# EasyEDA schematic SCH_EDR Project_2023-04-14.json
TITLE: Soil moisture meter; REV: 1.0; Date: 2023-04-14; Sheet: 1/1; Drawn By: charith_dombawala; Company: University Of Moratuwa
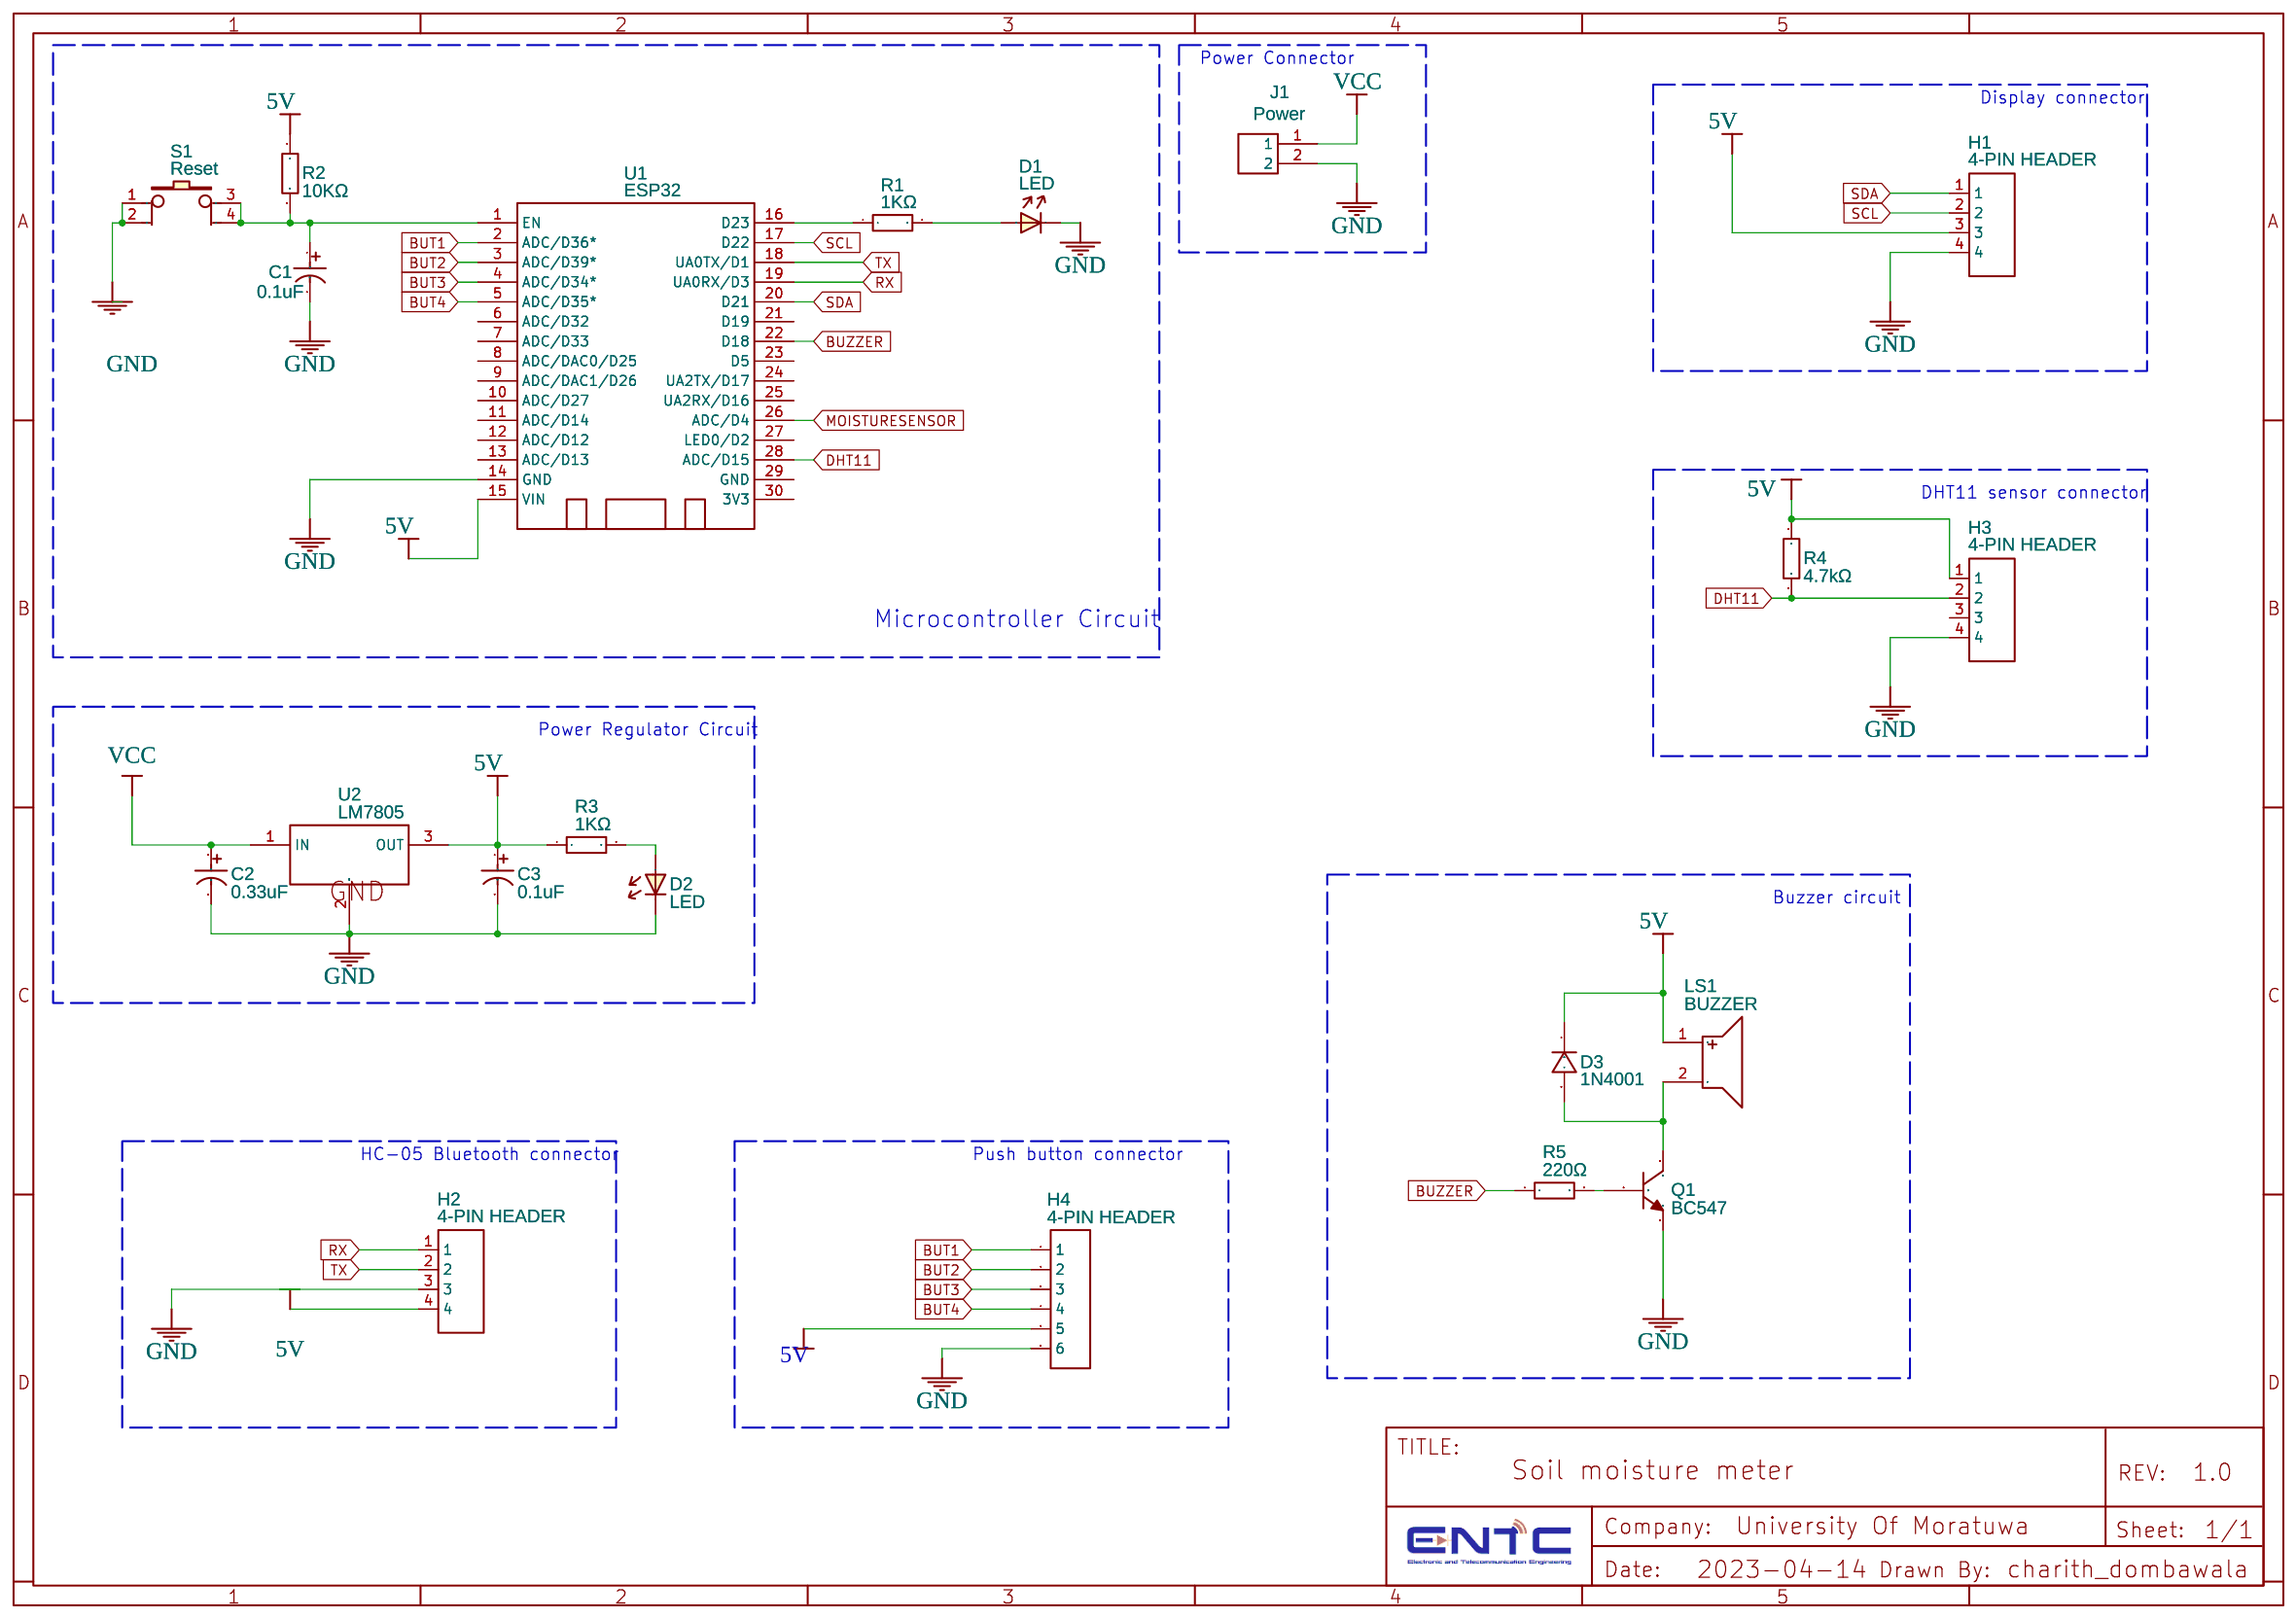
[diagram p0: schematic sheet]

## Parts
C1  0.1uF  [CAP-TH_BD5.0-P2.00-D0.8-FD]
C2  0.33uF  [CAP-TH_BD5.0-P2.00-D0.8-FD]
C3  0.1uF  [CAP-TH_BD5.0-P2.00-D0.8-FD]
D1  LED  [5MM LED]
D2  LED  [5MM LED]
D3  1N4001  [DO-41_BD2.4-L4.7-P8.70-D0.9-RD]
H1  4-PIN HEADER  [HEADER - HEADER-FEMALE-2.54_1X4]
H2  4-PIN HEADER  [HEADER - HEADER-FEMALE-2.54_1X4]
H3  4-PIN HEADER  [HEADER - HEADER-FEMALE-2.54_1X4]
H4  4-PIN HEADER  [HDR-F-2.54_1X6]
J1  Power  [CONN-TH_XHB-2A]
LS1  BUZZER  [DIP-BUZZER-12X6]
Q1  BC547  [TO-92-3_L4.9-W3.7-P2.54-L]
R1  1KΩ  [AXIAL-0.4]
R2  10KΩ  [AXIAL-0.4]
R3  1KΩ  [AXIAL-0.4]
R4  4.7kΩ  [AXIAL-0.4]
R5  220Ω  [AXIAL-0.4]
S1  Reset  [KEY-TH_4P-L6.0-W6.0-P4.50]
U1  ESP32  [DOIT-ESP32-DEVKIT-V1]
U2  LM7805  [TO-220-3_L10.0-W4.5-P2.54-L]

## Library data of the parts
C1 C3 = 0.1uF: Supplier: LCSC; Manufacturer: ValuePro; Manufacturer Part: 0.1UF 50V; Supplier Part: C28061; JLCPCB Part Class: Extended Part
C2 = 0.33uF: Supplier: LCSC; Manufacturer: ValuePro; Manufacturer Part: 0.33uF 50V 5*11; Supplier Part: C45097; JLCPCB Part Class: Extended Part
D1 D2 = LED: Manufacturer Part: 5mm LED; Contributor: Axbri
D3 = 1N4001: Supplier: LCSC; Supplier Part: C99656; Manufacturer: Diodes Incorporated; Contributor: LCSC; JLCPCB Part Class: Extended Part
H1-H3 = HEADER - HEADER-FEMALE-2.54_1X4: Contributor: Kang Yi Te; Supplier: Sparkfun
H4 = HDR-F-2.54_1x6: Supplier Part: C40877; Supplier: LCSC; Contributor: LCEDA_Lib
J1 = JST_2 PIN: Supplier: LCSC; Manufacturer: BOOMELE; Manufacturer Part: XHB-2A Connector; image: //image.lceda.cn/szlcsc/C57981.jpg; Supplier Part: C57981; JLCPCB Part Class: Extended Part
LS1 = BUZZER: Supplier: LCSC; Manufacturer: HNDZ; Manufacturer Part: BUZZERHMB1206-03; Contributor: วริศรา เกรียงไกรวัฒน์ /ทิพพะ; Supplier Part: C96101
Q1 = BC547BTF: Supplier: LCSC; Supplier Part: C900798; Manufacturer: onsemi(安森美); Contributor: LCSC; JLCPCB Part Class: Extended Part
R1-R5 = RESISTOR: Power: 1/4W; Tolerance: ±1%; EasyEDA: E57439; Supplier Part: E57439; Supplier: LCSC; Manufacturer: UniOhm; Manufacturer Part: MFR0W4F2200A50
S1 = Push_Button: Supplier Part: C59980; Supplier: LCSC; Manufacturer: ReliaPro; Manufacturer Part: button6*6*8.5; image: http://image.lceda.cn/szlcsc/C59980.jpg
U1 = MODIFIED_ESP32-DEVKIT-V1 DOIT: Contributor: ConceitoTeam
U2 = 7805(TO-220): Supplier: LCSC; Manufacturer: STMicroelectronics; Manufacturer Part: L7805CV-DG; Supplier Part: C3795; Contributor: LCEDA_Lib

## Nets
5V: C3.1 D3.1(C) H1.3 H2.4 H3.1 H4.5 LS1.1 R2.1 R3.1 R4.1 U1.15(VIN) U2.3(OUT)
GND: C1.2 C2.2 C3.2 D1.2 D2.2 H1.4 H2.3 H3.4 H4.6 J1.2 Q1.3(E) S1.1 S1.2 U1.14(GND) U2.2(GND)
VCC: C2.1 J1.1 U2.1(IN)
BUT1: H4.1 U1.2(ADC/D36*)
BUT2: H4.2 U1.3(ADC/D39*)
BUT3: H4.3 U1.4(ADC/D34*)
BUT4: H4.4 U1.5(ADC/D35*)
BUZZER: R5.1 U1.22(D18)
DHT11: H3.2 R4.2 U1.28(ADC/D15)
MOISTURESENSOR: U1.26(ADC/D4)
RX: H2.1 U1.19(UA0RX/D3)
SCL: H1.2 U1.17(D22)
SDA: H1.1 U1.20(D21)
TX: H2.2 U1.18(UA0TX/D1)
Net-(C1-1): C1.1 R2.2 S1.3 S1.4 U1.1(EN)
Net-(D1-1): D1.1 R1.2
Net-(D2-1): D2.1 R3.2
Net-(D3-2): D3.2(A) LS1.2 Q1.1(C)
Net-(Q1-2): Q1.2(B) R5.2
Net-(R1-1): R1.1 U1.16(D23)

Not connected (* = marked no-connect by the designer): H3 3; U1 6(ADC/D32) 7(ADC/D33) 8(ADC/DAC0/D25) 9(ADC/DAC1/D26) 10(ADC/D27) 11(ADC/D14) 12(ADC/D12) 13(ADC/D13) 21(D19) 23(D5) 24(UA2TX/D17) 25(UA2RX/D16) 27(LED0/D2) 29(GND) 30(3V3)

## Notes on the sheet
- Power Connector
- Display connector
- DHT11 sensor connector
- Microcontroller Circuit
- Power Regulator Circuit
- Buzzer circuit
- HC-05 Bluetooth connector
- Push button connector
